# Altium schematic sheet IMU.SchDoc
size A; SheetNumber: 6; SheetTotal: 11
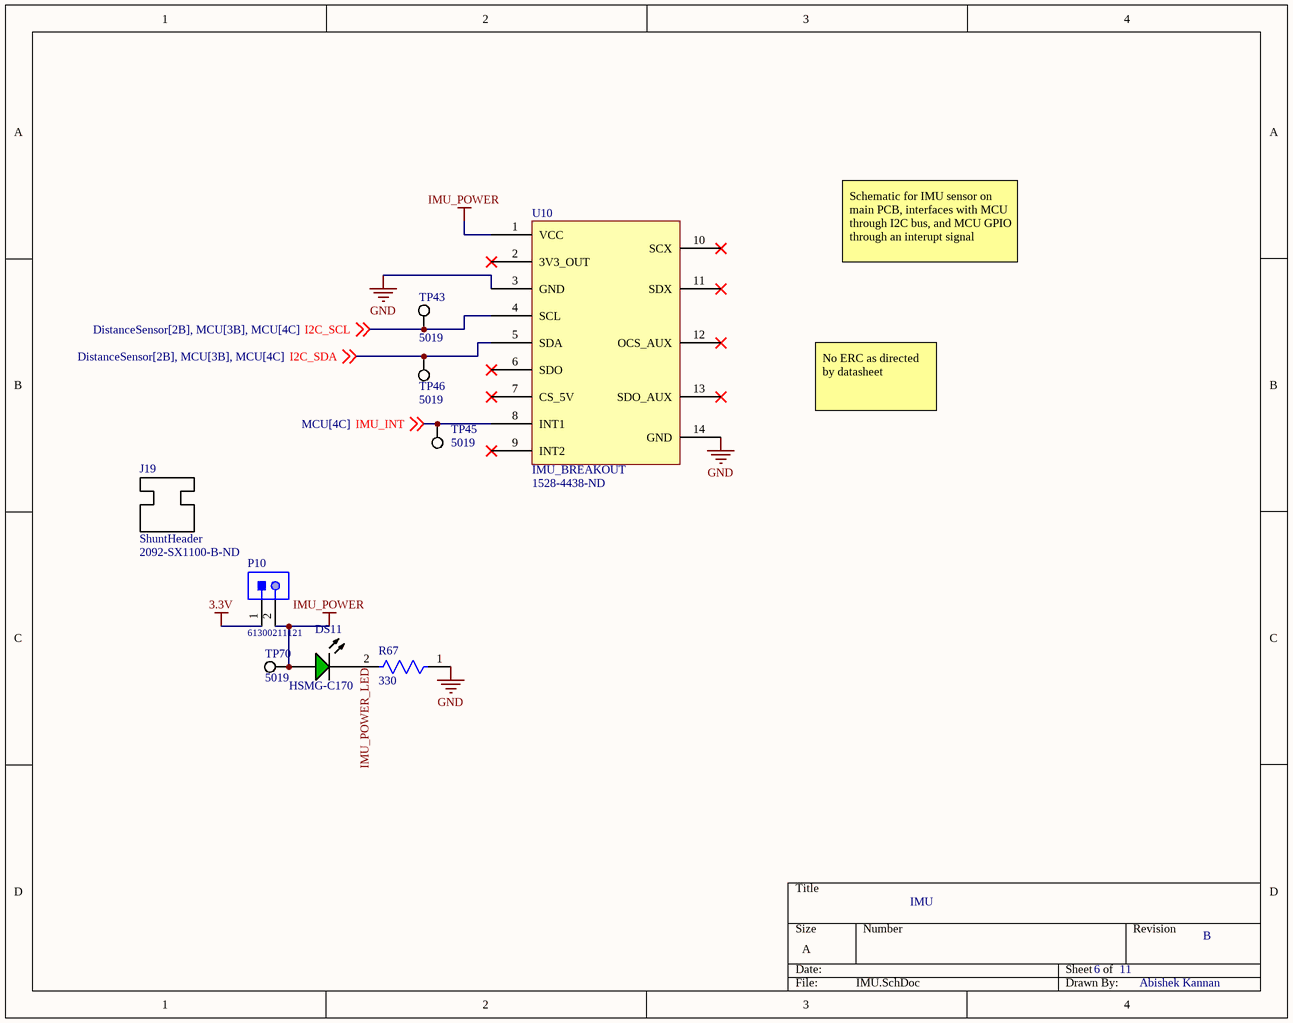
[diagram p0: IMU.SchDoc]

## Parts
DS11  HSMG-C170  [AVAG-HSMX-C170_V]
J19  ShuntHeader  Supplier Part Number 1: 2092-SX1100-B-ND
P10  61300211121  [61300211121]
R67  330  [FP-CRCW0805-e3-MFG]
TP43  5019  [KSTN-5019_V]
TP45  5019  [KSTN-5019_V]
TP46  5019  [KSTN-5019_V]
TP70  5019  [KSTN-5019_V]
U10  IMU_BREAKOUT  Supplier Part Number 1: 1528-4438-ND  [IMU_BREAKOUT]

## Nets
3.3V: P10.1
GND: R67.1 U10.3(GND) U10.14(GND)
IMU_POWER: DS11.1(A) P10.2 TP70.1 U10.1(VCC)
I2C_SCL: TP43.1 U10.4(SCL) ; off-sheet I2C_SCL
I2C_SDA: TP46.1 U10.5(SDA) ; off-sheet I2C_SDA
IMU_INT: TP45.1 U10.8(INT1) ; off-sheet IMU_INT
IMU_POWER_LED: DS11.2(K) R67.2

Not connected (* = marked no-connect by the designer): U10 2(3V3_OUT)* 6(SDO)* 7(CS_5V)* 9(INT2)* 10(SCX)* 11(SDX)* 12(OCS_AUX)* 13(SDO_AUX)*

## Notes on the sheet
- Schematic for IMU sensor on main PCB, interfaces with MCU through I2C bus, and MCU GPIO through an interupt signal
- No ERC as directed by datasheet
- IMU
- 11
- B
- Abishek Kannan

## Library data of the parts
DS11 = CMP-2000-05062-1: Chip LED, Green, 2.2 V, -40 to 85 degC, 2-Pin SMD, Pb-Free, Tape and Reel; Manufacturer: Avago; No. of Pins: 2; Peak Wavelength: 570nm; SVHC: NoSVHC(16-Jun-2014); Dominant Wavelength: 572nm; Forward Current If: 20mA; Viewing Angle: 170deg; Lens Shape: Rectangular; PIV Max: 5V; External Width: 1.25mm; LED Type: Standard; External Depth: 0.8mm; Opto Mounting Orientation: Top; Luminous Intensity: 15mcd; Luminous Intensity Min: 4mcd; Forward Voltage VF Max: 2.6V; External Length / Height: 2mm; Bulb Size: 1.25mmx1.4mm; Light Area Height: 1mm; Voltage Vf Typ: 2.2V; Operating Temperature Max: 85degC; Datasheet Version: Oct-08; MSL: MSL2A-4weeks; Peak Forward Current: 20mA; Package Description: 2-Pin Surface Mount Device, Body 2 x 1.25 mm, Height 0.8 mm; Datasheet URL: https://datasheet.ciiva.com/29280/180495-da-01-en-chip-led-hsmg-c170-gelb-gruen-29280971.pdf; Storage Temperature Min: -40degC; LED Colour: Green; Wavelength Typ: 570nm; Mounting Type: SMD; Forward Current If Max: 20mA; Dominant Wavelength Typ: 572nm; LED Mounting: SMD; Operating Temperature Range: -30degCto+85degC; Operating Temperature Min: -30degC; Manufacturer URL: http://www.avagotech.com/; Packaging: CutTape; Luminous Intensity Typ: 15mcd; Package Reference: HSMX-C170; Storage Temperature Max: 85degC; Opto Case Style: SMD; Forward Voltage: 2.2V
J19 = ShuntHeader: Conn Mini Shunt 2 POS 2.54mm Black Cable Mount; Manufacturer: Kycon; Manufacturer Part Number: SX1100-B; Current Rating: 3A; Number of Positions: 2; Insulation Resistance: 1GR; Supplier 1: Digi-Key; RoHS: Yes; Category: Headers and Wire Housings; Stock 1: 85316; Pricing 1: 1=0.10000, 10=0.06000, 25=0.04920, 50=0.04540, 100=0.04390, 250=0.03788, 500=0.03636, 1000=0.03182, 2500=0.02878 (USD); Contact Plating: Gold; Contact Material: Bronze; Housing Material: Thermoplastic; Min Operating Temperature: -55°C; Max Operating Temperature: 125°C; Number of Rows: 1; Contact Gender: Female; Packaging: Bulk; Pitch: 2.54mm; Flammability Rating: UL94 V-0; RoHS Compliant: Yes; ComponentLink1URL: http://www.mouser.com/ds/2/222/SX1100-B-461401.pdf?src-supplier=Mouser; ComponentLink1Description: http://www.mouser.com/ds/2/222/SX1100-B-461401.pdf?src-supplier=Mouser
P10 = CMP-1712-00002-4: THT Vertical Pin Header WR-PHD, Pitch 2.54 mm, Single Row, 2 pins; Manufacturer: Wurth Elektronik; Rated Current: 3A; Gender: Male; Withstanding Voltage: 500VAC; Working Voltage: 250VAC; Pitch: 2.54mm; Contact Resistance: 20mOhm; Pin Number: 2; Voltage Rating: 250V; Connector Type: Male Pin; Mounting Technology: THT; Orientation: Vertical; Operating Temperature: -40to105degC; Packaging: Bag; Publisher: WurthElektronik; Datasheet URL: https://katalog.we-online.de/em/datasheet/6130xx11121.pdf; Manufacturer URL: http://www.we-online.de; Row Number: Single; Package Reference: 61300211121; Part Number: 61300211121; Supplier 1: Digi-Key; Supplier Part Number 1: 732-5315-ND; Manufacturer Part Number: 61300211121; RoHS: Yes; Category: Headers and Wire Housings; Stock 1: 204500; Pricing 1: 1=0.13000, 10=0.11300, 25=0.09400, 50=0.07900, 100=0.07100, 1000=0.06500 (USD); Contact Plating: Gold; Housing Material: PBT; Contact Material: Copper Alloy,Copper; Color: Black; Min Operating Temperature: -40°C; Max Operating Temperature: 125°C; Number of Rows: 1; Contact Gender: Male; Current Rating: 3A; Number of Positions: 2; Termination: Through Hole; Number of Contacts: 2; Series: WR-PHD; Contact Type: Male Pin; Contact Mating Length: 0.236inch; Lead Free: Lead Free; RoHS Compliant: Yes; ComponentLink1URL: https://datasheet.ciiva.com/13619/6130xx11121-48870-13619345.pdf?src-supplier=Mouser; ComponentLink1Description: https://datasheet.ciiva.com/13619/6130xx11121-48870-13619345.pdf?src-supplier=Mouser
R67 = CMP-2001-03823-2: RES Thick Film, 330Ω, 1%, 0.125W, 100ppm/°C, 0805; Manufacturer: Vishay; Manufacturer Part Number: CRCW0805330RFKEA; Voltage Rating (DC): 150V; Resistance: 330R; Max Power Dissipation: 125mW; Mount: Surface Mount; Packaging: Tape and Reel; Min Operating Temperature: -55°C; Military Standard: Not; Case Code (Metric): 2012; Height: 0.02inch; Voltage Rating: 150V; Case/Package: 0805; Max Operating Temperature: 155°C; Width: 0.049inch; Case Code (Imperial): 0805; Termination: SMD/SMT; Lead Free: Lead Free; Contact Plating: Tin; Package Quantity: 10; Composition: Thick Film; Length: 2mm; Features: Automotive AEC-Q200; Depth: 1.25mm; Weight: 0.000194oz; Tolerance: 1%; Power Rating: 125mW; Number of Terminations: 2; Temperature Coefficient: 100ppm/°C; Supplier 1: Digi-Key; Supplier Part Number 1: 541-330CCT-ND; RoHS: Yes; Category: Chip SMD Resistors; Stock 1: 1889; Pricing 1: 1=0.10000, 10=0.06700, 100=0.02710, 1000=0.01219, 2500=0.01058 (USD); Size Code: 0805; Series: CRCW; Resistor Type: Thick Film; Construction: Rectangular; Resistance Tolerance: 1%; Ratings: AEC-Q200; RoHS Compliant: Yes; ComponentLink1URL: https://datasheet.ciiva.com/8944/dcrcwe3-8944773.pdf?src-supplier=Avnet; ComponentLink1Description: https://datasheet.ciiva.com/8944/dcrcwe3-8944773.pdf?src-supplier=Avnet; ComponentLink2URL: https://datasheet.ciiva.com/8944/dcrcwe3-8944776.pdf?src-supplier=Avnet; ComponentLink2Description: https://datasheet.ciiva.com/8944/dcrcwe3-8944776.pdf?src-supplier=Avnet; ComponentLink3URL: https://datasheet.ciiva.com/2495/dcrcwe3-2495803.pdf?src-supplier=Digi-Key; ComponentLink3Description: https://datasheet.ciiva.com/2495/dcrcwe3-2495803.pdf?src-supplier=Digi-Key; ComponentLink4URL: https://datasheet.ciiva.com/2495/dcrcwe3-2495804.pdf?src-supplier=Digi-Key; ComponentLink4Description: https://datasheet.ciiva.com/2495/dcrcwe3-2495804.pdf?src-supplier=Digi-Key; ComponentLink5URL: https://datasheet.ciiva.com/2495/dcrcwe3-2495805.pdf?src-supplier=Digi-Key; ComponentLink5Description: https://datasheet.ciiva.com/2495/dcrcwe3-2495805.pdf?src-supplier=Digi-Key; ComponentLink6URL: https://datasheet.ciiva.com/5545/dcrcwe3-109170-5545357.pdf?src-supplier=Mouser; ComponentLink6Description: https://datasheet.ciiva.com/5545/dcrcwe3-109170-5545357.pdf?src-supplier=Mouser; ComponentLink7URL: https://datasheet.ciiva.com/16769/70201119-16769852.pdf?src-supplier=Allied+Electronics; ComponentLink7Description: https://datasheet.ciiva.com/16769/70201119-16769852.pdf?src-supplier=Allied+Electronics; ComponentLink8URL: https://datasheet.ciiva.com/7777/1697337-7777390.pdf?src-supplier=Element14; ComponentLink8Description: https://datasheet.ciiva.com/7777/1697337-7777390.pdf?src-supplier=Element14; ComponentLink9URL: https://datasheet.ciiva.com/7777/1720486-7777573.pdf?src-supplier=Element14; ComponentLink9Description: https://datasheet.ciiva.com/7777/1720486-7777573.pdf?src-supplier=Element14
TP43 TP45 TP46 TP70 = CMP-1672-00008-1: Test Point, 1 Position SMD, RoHS, Tape and Reel; Manufacturer: Keystone Electronics; Body Material: Bronze; Plating: Silver; ComponentLink1Description: Manufacturer URL; Package Quantity: 1000; DatasheetVersion: 03/2014; Packaging: Tape and Reel; ComponentLink2URL: http://www.keyelco.com/product-pdf.cfm?p=1357; ComponentLink1URL: http://www.keyelco.com/; Mount: Surface Mount; Contact Plating: Silver; PackageDescription: 1-Pin Surface Mount Device, Body 3.81 x 2.03 mm; Pins: 1; RoHSCompliant: True; Mounting Technology: Surface Mount; ComponentLink2Description: Datasheet; PackageReference: 5019; Supplier 1: Digi-Key; Supplier Part Number 1: 36-5019CT-ND; Manufacturer Part Number: 5019; RoHS: Yes; Category: Connectors; Stock 1: 1009631; Pricing 1: 1=0.34000, 25=0.27360, 100=0.22340, 250=0.20064, 500=0.19152 (USD); Number of Pins: 1; Material: Bronze; Contact Material: Bronze; Series: 5019; Termination: SMD/SMT; Height: 0.09inch; RoHS Compliant: Yes; Reach SVHC Compliant: Yes; Lead Free: Lead Free; ComponentLink3URL: https://datasheet.ciiva.com/16885/70182998-16885945.pdf?src-supplier=Allied+Electronics; ComponentLink3Description: https://datasheet.ciiva.com/16885/70182998-16885945.pdf?src-supplier=Allied+Electronics; ComponentLink4URL: https://datasheet.ciiva.com/14848/m60-2p61-14848437.pdf?src-supplier=Digi-Key; ComponentLink4Description: https://datasheet.ciiva.com/14848/m60-2p61-14848437.pdf?src-supplier=Digi-Key; ComponentLink5URL: https://datasheet.ciiva.com/14848/m60-2p61-14848438.pdf?src-supplier=Digi-Key; ComponentLink5Description: https://datasheet.ciiva.com/14848/m60-2p61-14848438.pdf?src-supplier=Digi-Key; ComponentLink6URL: https://datasheet.ciiva.com/14848/m60-2p61-14848439.pdf?src-supplier=Digi-Key; ComponentLink6Description: https://datasheet.ciiva.com/14848/m60-2p61-14848439.pdf?src-supplier=Digi-Key; ComponentLink7URL: https://datasheet.ciiva.com/16318/m60-2p61-16318395.pdf?src-supplier=Future+Electronics; ComponentLink7Description: https://datasheet.ciiva.com/16318/m60-2p61-16318395.pdf?src-supplier=Future+Electronics
U10 = IMU_BREAKOUT: Manufacturer: Adafruit Industries; Manufacturer Part Number: 4438; Supplier 1: Digi-Key; RoHS: No; Stock 1: 23; Pricing 1: 1=11.95000 (USD)